# EAGLE design MKV30F128VFL10PminimumV2 (EAGLE 6.1)
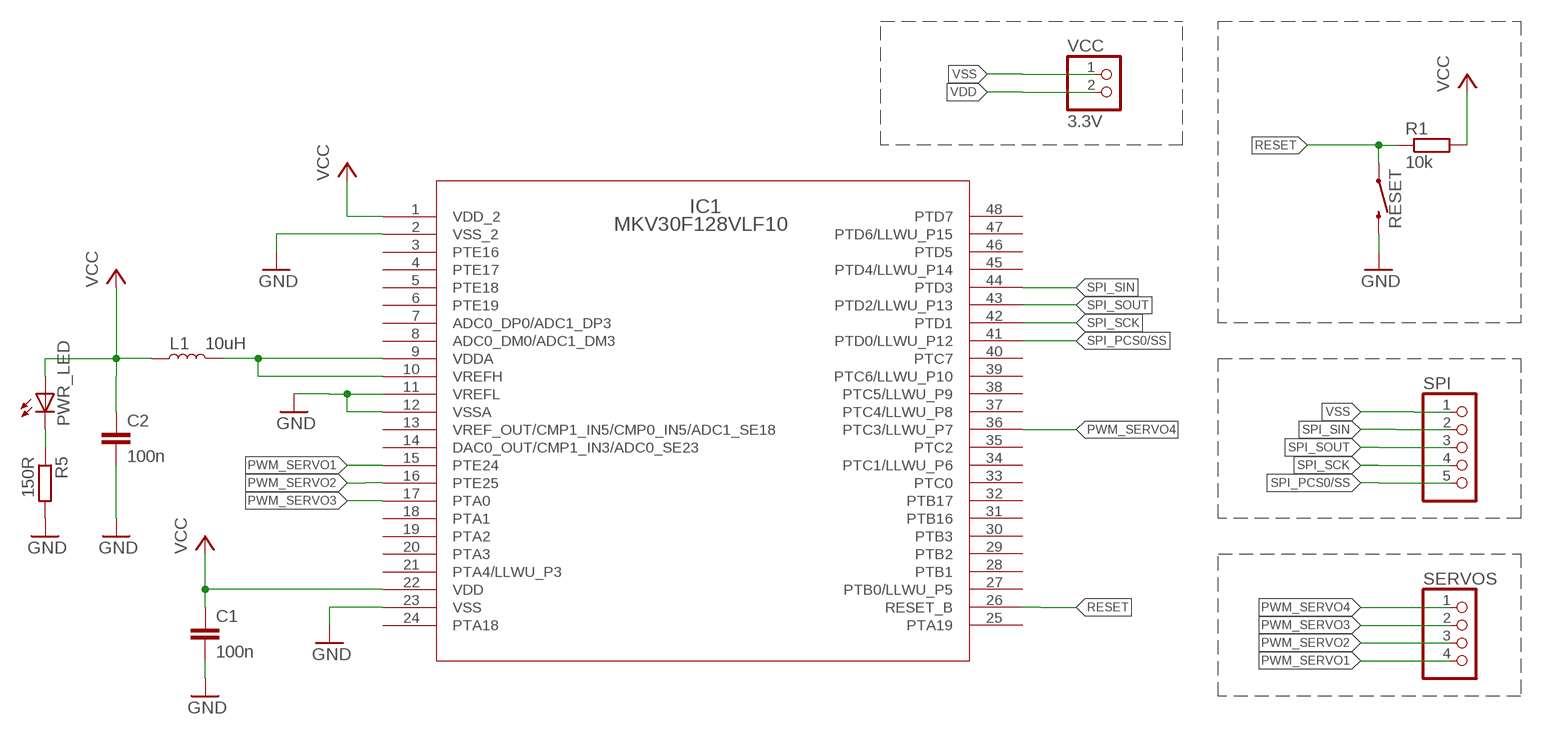
[diagram p0: schematic, sheet 1]

## Parts
C1  100n  C-EUC0805  [C0805]
C2  100n  C-EUC0805  [C0805]
IC1  MKV30F128VLF10  [LQFP-48_7X7X1.6]
L1  10uH  INDUCTOR-0805-3.3UH  [0805]
PWR_LED  LEDCHIP-LED0805  [CHIP-LED0805]
R1  10k  R-EU_R0805W  [R0805W]
R5  150R  R-EU_R0805W  [R0805W]
RESET  MOMENTARY-SWITCH-SPST-SMD-6.0X3.5MM  [TACTILE_SWITCH_SMD_6.0X3.5MM]
SERVOS  PINHD-1X4/90  [1X04/90]
SPI  PINHD-1X5/90  [1X05/90]
VCC  3.3V  PINHD-1X2/90  [1X02/90]

## Nets
N$7: PWR_LED.C R5.1
PWM_SERVO1: IC1.15(PTE24) SERVOS.4
PWM_SERVO2: IC1.16(PTE25) SERVOS.3
PWM_SERVO3: IC1.17(PTA0) SERVOS.2
PWM_SERVO4: IC1.36(PTC3/LLWU_P7) SERVOS.1
RESET: IC1.26(RESET_B) R1.1 RESET.1
SPI_PCS0/SS: IC1.41(PTD0/LLWU_P12) SPI.5
SPI_SCK: IC1.42(PTD1) SPI.4
SPI_SIN: IC1.44(PTD3) SPI.2
SPI_SOUT: IC1.43(PTD2/LLWU_P13) SPI.3
VDD: C1.1 C2.1 IC1.1(VDD_2) IC1.22(VDD) L1.1 PWR_LED.A R1.2 VCC.2 ; supply symbol labelled VCC
VDDA: IC1.9(VDDA) IC1.10(VREFH) L1.2
VSS: C1.2 C2.2 IC1.2(VSS_2) IC1.11(VREFL) IC1.12(VSSA) IC1.23(VSS) R5.2 RESET.2 SPI.1 VCC.1 ; supply symbol labelled GND
Unconnected: IC1.3(PTE16) IC1.4(PTE17) IC1.5(PTE18) IC1.6(PTE19) IC1.7(ADC0_DP0/ADC1_DP3) IC1.8(ADC0_DM0/ADC1_DM3) IC1.13(VREF_OUT/CMP1_IN5/CMP0_IN5/ADC1_SE18) IC1.14(DAC0_OUT/CMP1_IN3/ADC0_SE23) IC1.18(PTA1) IC1.19(PTA2) IC1.20(PTA3) IC1.21(PTA4/LLWU_P3) IC1.24(PTA18) IC1.25(PTA19) IC1.27(PTB0/LLWU_P5) IC1.28(PTB1) IC1.29(PTB2) IC1.30(PTB3) IC1.31(PTB16) IC1.32(PTB17) IC1.33(PTC0) IC1.34(PTC1/LLWU_P6) IC1.35(PTC2) IC1.37(PTC4/LLWU_P8) IC1.38(PTC5/LLWU_P9) IC1.39(PTC6/LLWU_P10) IC1.40(PTC7) IC1.45(PTD4/LLWU_P14) IC1.46(PTD5) IC1.47(PTD6/LLWU_P15) IC1.48(PTD7)

## Library data of the parts
C1 C2 = resistor:C-EU: CAPACITOR, European symbol
IC1 = MKV30F128Vxx10P:MKV30F128VLF10; CPU: ARM Cortex-M4F; FLASHKB: 128; MANUFACTURER_PART_NUMBER: mkv30f128vlf10; MAXFREQUENCY: 100; PINCOUNT: 48; SRAMKB: 16; VENDOR: FREESCALE
L1 = SparkFun-Coils:INDUCTOR: Inductors Resist changes in electrical current. Basically a coil of wire. SparkFun Products: SparkFun Load Cell Amplifier - HX711 <https://www.sparkfun.com/products/13879> IOIO-OTG - V2.2 <https://www.sparkfun.com/products/13613>; PROD_ID: NDUC-13076; VALUE: 3.3µH/±20%/450mA
PWR_LED = led:LED: LED OSRAM: - CHIPLED LG R971, LG N971, LY N971, LG Q971, LY Q971, LO R971, LY R971 LH N974, LH R974 LS Q976, LO Q976, LY Q976 LO Q996 - Hyper CHIPLED LW Q18S LB Q993, LB Q99A, LB R99A - SideLED LS A670, LO A670, LY A670, LG A670, LP A670 LB A673, LV A673, LT A673, LW A673 LH A674 LY A675 LS A676, LA A676, LO A676, LY A676, LW A676 LS A679, LY A679, LG A679 - Hyper Micro SIDELED® LS Y876, LA Y876, LO Y876, LY Y876 LT Y87S - SmartLED LW L88C, LW L88S LB L89C, LB L89S, LG L890 LS L89K, LO L89K, LY L89K LS L896, LA L896, LO L896, LY L896 - TOPLED LS T670, LO T670, LY T670, LG T670, LP T670 LSG T670, LSP T670, LSY T670, LOP T670, LYG T670 LG T671, LOG T671, LSG T671 LB T673, LV T673, LT T673, LW T673 LH T674 LS T676, LA T676, LO T676, LY T676, LB T676, LH T676, LSB T676, LW T676 LB T67C, LV T67C, LT T67C, LS T67K, LO T67K, LY T67K, LW E67C LS E67B, LA E67B, LO E67B, LY E67B, LB E67C, LV E67C, LT E67C LW T67C LS T679, LY T679, LG T679 LS T770, LO T770, LY T770, LG T770, LP T770 LB T773, LV T773, LT T773, LW T773 LH T774 LS E675, LA E675, LY E675, LS T675 LS T776, LA T776, LO T776, LY T776, LB T776 LHGB T686 LT T68C, LB T68C - Hyper Mini TOPLED® LB M676 - Mini TOPLED Santana® LG M470 LS M47K, LO M47K, LY M47K Source: http://www.osram.convergy.de LUXEON: - LUMILED® LXK2-PW12-R00, LXK2-PW12-S00, LXK2-PW14-U00, LXK2-PW14-V00 LXK2-PM12-R00, LXK2-PM12-S00, LXK2-PM14-U00 LXK2-PE12-Q00, LXK2-PE12-R00, LXK2-PE12-S00, LXK2-PE14-T00, LXK2-PE14-U00 LXK2-PB12-K00, LXK2-PB12-L00, LXK2-PB12-M00, LXK2-PB14-N00, LXK2-PB14-P00, LXK2-PB14-Q00 LXK2-PR12-L00, LXK2-PR12-M00, LXK2-PR14-Q00, LXK2-PR14-R00 LXK2-PD12-Q00, LXK2-PD12-R00, LXK2-PD12-S00 LXK2-PH12-R00, LXK2-PH12-S00 LXK2-PL12-P00, LXK2-PL12-Q00, LXK2-PL12-R00 Source: www.luxeon.com KINGBRIGHT: KA-3528ASYC Source: www.kingbright.com
R1 R5 = rcl:R-EU_: RESISTOR, European symbol
RESET = SparkFun-Switches:MOMENTARY-SWITCH-SPST: Momentary Switch (Pushbutton) - SPST Normally-open (NO) SPST momentary switches (buttons, pushbuttons). Variants PTH-12MM - 12mm square, through-hole Momentary Pushbutton Switch - 12mm Square <https://www.sparkfun.com/products/9190> (COM-09190) PTH-6.0MM, PTH-6.0MM-KIT - 6.0mm square, through-hole Mini Pushbutton Switch <https://www.sparkfun.com/products/97> (COM-00097) KIT package intended for soldering kit's - only one side of pads' copper is exposed. PTH-RIGHT-ANGLE-KIT - Right-angle, through-hole Right Angle Tactile Button <https://www.sparkfun.com/products/10791> - Used on SparkFun BigTime Watch Kit <https://www.sparkfun.com/products/11734> SMD-12MM - 12mm square, surface-mount Tactile Button - SMD (12mm) <https://www.sparkfun.com/products/12993> (COM-12993) Used on SparkFun PicoBoard <https://www.sparkfun.com/products/11888> SMD-4.5MM - 4.5mm Square Trackball Switch Used on SparkFun Blackberry Trackballer Breakout <https://www.sparkfun.com/products/13169> SMD-4.6MMX2.8MM - 4.60mm x 2.80mm, surface mount Used on SparkFun SAMD21 Mini Breakout <https://www.sparkfun.com/products/13664> SMD-5.2MM, SMD-5.2-REDUNDANT - 5.2mm square, surface-mount Mini Pushbutton Switch - SMD <https://www.sparkfun.com/products/8720> (COM-08720) Used on Arduino Pro Mini <https://www.sparkfun.com/products/11114> REDUNDANT package connects both switch circuits together SMD-6.0X3.5MM - 6.0 x 3.5mm, surface mount Momentary Reset Switch SMD <https://www.sparkfun.com/products/8229> (COM-08229) SMD-6.2MM-TALL - 6.2mm square, surface mount Tactile Button - SMD (6mm) <https://www.sparkfun.com/products/12992> Used on SparkFun Digital Sandbox <https://www.sparkfun.com/products/12651> SMD-RIGHT-ANGLE - Right-angle, surface mount Used on SparkFun Block for Intel® Edison - Arduino <https://www.sparkfun.com/products/13036>; PROD_ID: SWCH-00815; SF_SKU: COM-08229
SERVOS = pinhead:PINHD-1X4: PIN HEADER
SPI = pinhead:PINHD-1X5: PIN HEADER
VCC = pinhead:PINHD-1X2: PIN HEADER

## Board
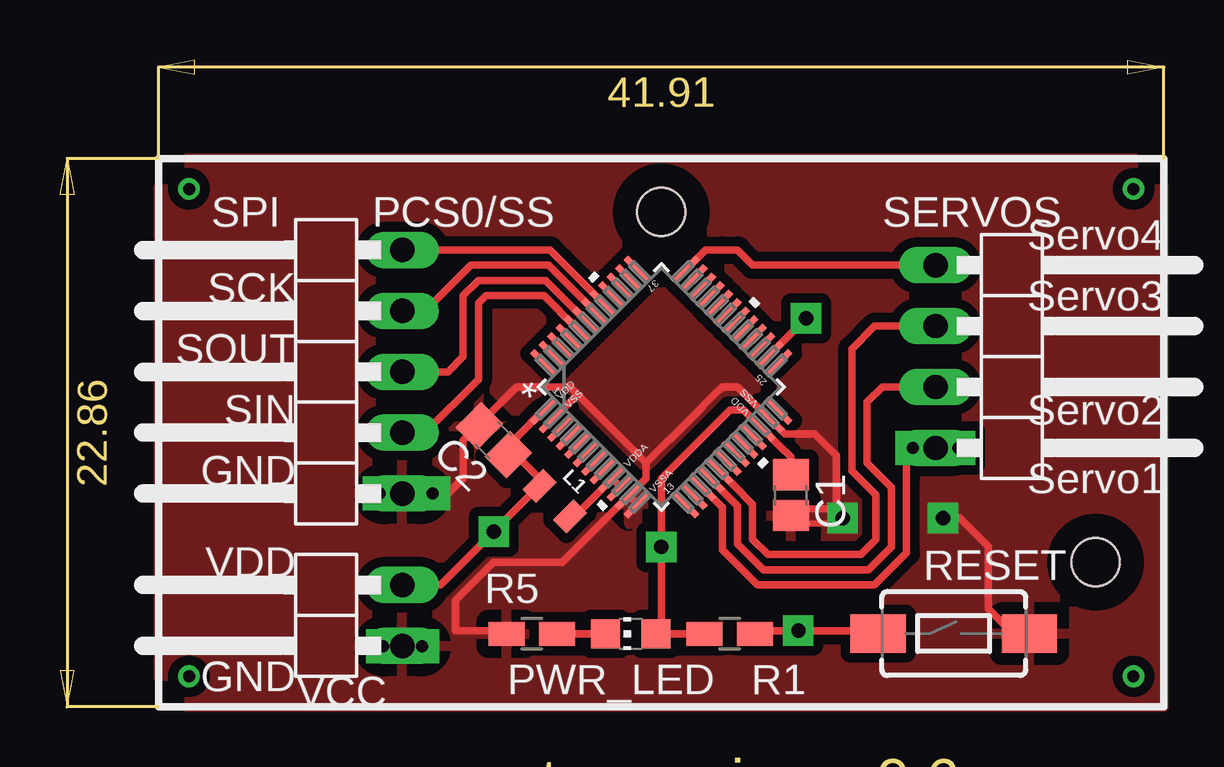
[diagram p1: board, top side]
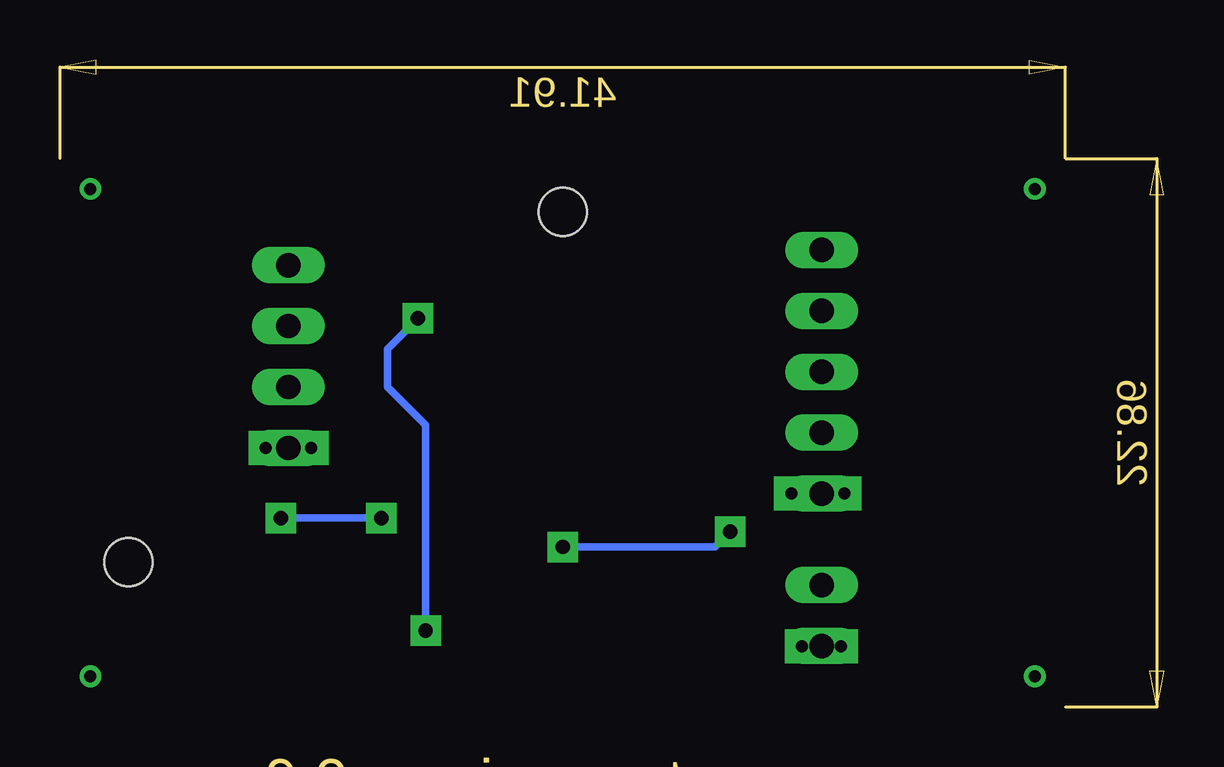
[diagram p2: board, bottom side, seen from below]

Size 46.02 x 26.97 mm. Coordinates in mm from the lower left corner, seen from the top.
Copper layers (1*16): Top 0.035mm / dielectric 1.5mm / Bottom 0.035mm
Design rules: minimum track width 10mil, minimum drill 24mil, track to track 8mil, track to pad 8mil, pad to pad 8mil, via to via 8mil, smd to smd 8mil, copper to edge 40mil, drill to drill 8mil, minimum pad ring 10mil, minimum via ring 8mil, stop-mask expansion 4mil, vias tented up to drill 0mil, thermal gap 20mil
Holes 2 mm at 43.16,6.03 25.06,20.64

### Footprints (pad centres in the part's own frame; a part is rotated, then mirrored left to right if it is on the bottom)
C0805 = smd 1.3 x 1.5: 1 -0.85,0; 2 0.85,0
LQFP-48_7X7X1.6 = smd 1.411 x 0.27: 1 -4.15,2.75; 2 -4.15,2.25; 3 -4.15,1.75; 4 -4.15,1.25; 5 -4.15,0.75; 6 -4.15,0.25; 7 -4.15,-0.25; 8 -4.15,-0.75; 9 -4.15,-1.25; 10 -4.15,-1.75; 11 -4.15,-2.25; 12 -4.15,-2.75; 25 4.15,-2.75; 26 4.15,-2.25; 27 4.15,-1.75; 28 4.15,-1.25; 29 4.15,-0.75; 30 4.15,-0.25; 31 4.15,0.25; 32 4.15,0.75; 33 4.15,1.25; 34 4.15,1.75; 35 4.15,2.25; 36 4.15,2.75 | smd 0.27 x 1.411: 13 -2.75,-4.15; 14 -2.25,-4.15; 15 -1.75,-4.15; 16 -1.25,-4.15; 17 -0.75,-4.15; 18 -0.25,-4.15; 19 0.25,-4.15; 20 0.75,-4.15; 21 1.25,-4.15; 22 1.75,-4.15; 23 2.25,-4.15; 24 2.75,-4.15; 37 2.75,4.15; 38 2.25,4.15; 39 1.75,4.15; 40 1.25,4.15; 41 0.75,4.15; 42 0.25,4.15; 43 -0.25,4.15; 44 -0.75,4.15; 45 -1.25,4.15; 46 -1.75,4.15; 47 -2.25,4.15; 48 -2.75,4.15
0805 = smd 0.8 x 1.2: 1 -0.9,0; 2 0.9,0
CHIP-LED0805 = smd 1.2 x 1.2: A 0,-1.05; C 0,1.05
R0805W = smd 1.5 x 1: 1 -1.052,0; 2 1.052,0
TACTILE_SWITCH_SMD_6.0X3.5MM = smd 2.3 x 1.6: 1 -3.15,0; 2 3.15,0
1X04/90 = drill 1.016 long: 1 -3.81,-3.81; 2 -1.27,-3.81; 3 1.27,-3.81; 4 3.81,-3.81
1X05/90 = drill 1.016 long: 1 -5.08,-3.81; 2 -2.54,-3.81; 3 0,-3.81; 4 2.54,-3.81; 5 5.08,-3.81
1X02/90 = drill 1.016 long: 1 -1.27,-3.81; 2 1.27,-3.81

### Placement (x,y rotation side)
C1  30.46,8.83 270 top
C2  18.08,11.11 135 top
IC1  25.06,13.33 45 top
L1  20.62,8.57 315 top
PWR_LED  23.79,3.05 90 top
R1  27.92,3.05 180 top
R5  19.67,3.05 180 top
RESET  37.25,3.05 0 top
SERVOS  40.3,14.6 270 top
SPI  10.46,13.97 90 top
VCC  10.46,3.81 90 top

### Tracks (layer width: path | path; a pad name or v marks a point on that pad's centre or on a via)
N$1  (via drill 0.5 pad 0.25)
  other vias: 44.75,1.27
N$2  (via drill 1.3)
  other vias: 43.16,6.03
N$4  (via drill 0.5 pad 0.25)
  other vias: 44.75,21.59
N$5  (via drill 0.5 pad 0.25)
  other vias: 5.38,21.59
N$6  (via drill 0.5 pad 0.25)
  other vias: 5.38,1.27
N$7
  Top 0.305: R5.1 PWR_LED.C
N$21  (via drill 1.3)
  other vias: 25.06,20.64
PWM_SERVO1  (via drill 0.5 pad 1.42)
  Top 0.305: IC1.15 27.6,8.32 27.6,6.73 27.6,6.54 29.06,5.08 33.95,5.08 35.29,6.41 35.29,9.52 35.29,10.79 | 35.29,10.79 35.48,10.79 | 35.48,10.79 35.29,10.79 | 35.29,10.79 35.48,10.79 | 35.48,10.79 v35.54,10.79 SERVOS.4 v37.45,10.79
PWM_SERVO2
  Top 0.305: IC1.16 27.12,9.51 28.24,8.38 28.24,6.79 29.32,5.71 33.7,5.71 34.65,6.67 34.65,9.14 33.64,10.16 33.64,12.7 34.27,13.33 SERVOS.3
PWM_SERVO3
  Top 0.305: IC1.17 27.47,9.85 28.11,9.21 28.87,8.45 28.87,6.98 29.51,6.35 33.38,6.35 34.02,6.98 34.02,8.83 33,9.84 33,14.92 33.95,15.88 SERVOS.2
PWM_SERVO4
  Top 0.305: IC1.36 26.07,18.21 26.91,19.05 27.6,19.05 28.24,19.05 28.87,18.41 SERVOS.1
RESET  (via drill 0.6 pad 1.27)
  Top 0.305: IC1.26 v31.1,16.19 | R1.1 29.1,3.17 v30.78,3.17 33,3.17 | 33,3.17 33.03,3.17 | RESET.1 33.12,3.05 33,3.17
  Bottom 0.305: v31.1,16.19 32.37,14.92 32.37,13.33 31.1,12.06 30.78,11.75 30.78,4.45 30.78,4.13 30.78,3.49 | 30.78,3.49 v30.78,3.17 30.78,3.49
SPI_PCS0/SS
  Top 0.305: IC1.41 22.66,16.82 21.7,17.78 20.87,18.61 20.43,19.05 SPI.5
SPI_SCK
  Top 0.305: IC1.42 22.34,16.45 20.37,18.41 17.13,18.41 16.17,17.46 15.86,17.14 15.22,16.51 SPI.4
SPI_SIN
  Top 0.305: IC1.44 21.58,15.74 21.52,15.8 20.17,17.14 17.76,17.14 17.45,16.83 17.45,13.65 15.22,11.43 SPI.2
SPI_SOUT
  Top 0.305: IC1.43 21.93,16.09 20.24,17.78 17.45,17.78 16.81,17.14 16.81,14.6 16.17,13.97 15.86,13.97 SPI.3
VDD  (via drill 0.6 pad 1.27)
  Top 0.305: IC1.1 20.14,12.34 19.03,11.24 19.03,10.86 C2.1 19,10.51 19.35,10.16 19.98,9.53 L1.1 | 15.86,5.08 15.09,5.08 VCC.2 | 15.86,5.08 16.11,5.33 | 16.11,5.33 15.86,5.08 | 15.86,5.08 16.11,5.33 | C1.1 30.46,10.29 30.46,10.41 30.02,10.86 IC1.22 28.68,12.19 28.49,12.38 27.92,12.38 25.06,9.52 25.06,7.94 v25.06,6.67 25.06,3.27 PWR_LED.A R1.2 | L1.1 | v18.08,7.3 16.11,5.33 | 16.11,5.33 15.86,5.08 | 15.86,5.08 16.11,5.33 | 16.11,5.33 15.86,5.08 | 15.86,5.08 16.11,5.33 | 16.11,5.33 v18.08,7.3 | L1.1 18.93,8.17 18.08,7.32 v18.08,7.3
  Bottom 0.305: v18.08,7.3 18.71,6.67 23.79,6.67 v25.06,6.67
VDDA
  Top 0.305: IC1.10 IC1.9 | IC1.9 23.01,9.51 | L1.2 21.45,7.94 22.56,9.05 23.01,9.5 IC1.9
VSS  (via drill 0.5 pad 1.42, 0.6 pad 1.27)
  Top 0.254: C1.2 30.78,7.62 32.05,7.62 v32.62,7.87
  Top 0.305: IC1.11 IC1.12 | IC1.2 21.57,13.02 | SPI.1 v15.54,8.89 16.17,8.89 16.81,9.52 16.81,11.11 17.45,11.75 | 17.45,11.75 19.03,13.33 21.25,13.33 21.57,13.02 | IC1.11 24.43,9.52 24.43,10.16 | 24.43,10.16 21.57,13.02 | 24.43,10.16 26.34,12.06 27.29,13.02 27.6,13.33 28.24,13.33 28.87,12.7 IC1.23 30.21,11.37 31.48,11.37 32.37,10.48 32.37,8.25 | IC1.11 22.53,7.62 22.53,7.63 22.52,7.62 20.94,6.03 18.08,6.03 17.76,5.71 16.49,4.45 16.49,3.17 18.4,3.17 18.52,3.05 R5.2 | C2.2 17.45,11.75 | 32.37,8.25 v32.62,7.87 32.37,8.25 | 32.37,8.25 30.46,8.25 | v36.81,7.87 37.51,7.87 37.8,7.59 38.69,6.7 38.69,4.09 39.73,3.05 RESET.2 | v13.47,2.52 14.25,2.52 VCC.1
  Bottom 0.305: v32.62,7.87 v36.81,7.87
  other vias: 15.09,2.52 13.32,8.89
  pour Top (isolate 0.406): 4.11,22.86 4.11,0 46.02,0 46.02,22.86

### Text on the board
Dimension: otwory vias = 0.6mm | otwory montazowe = M2
tNames: PCS0/SS | Servo4 | SCK | Servo3 | SOUT | SIN | Servo2 | GND | Servo1 | VDD | GND